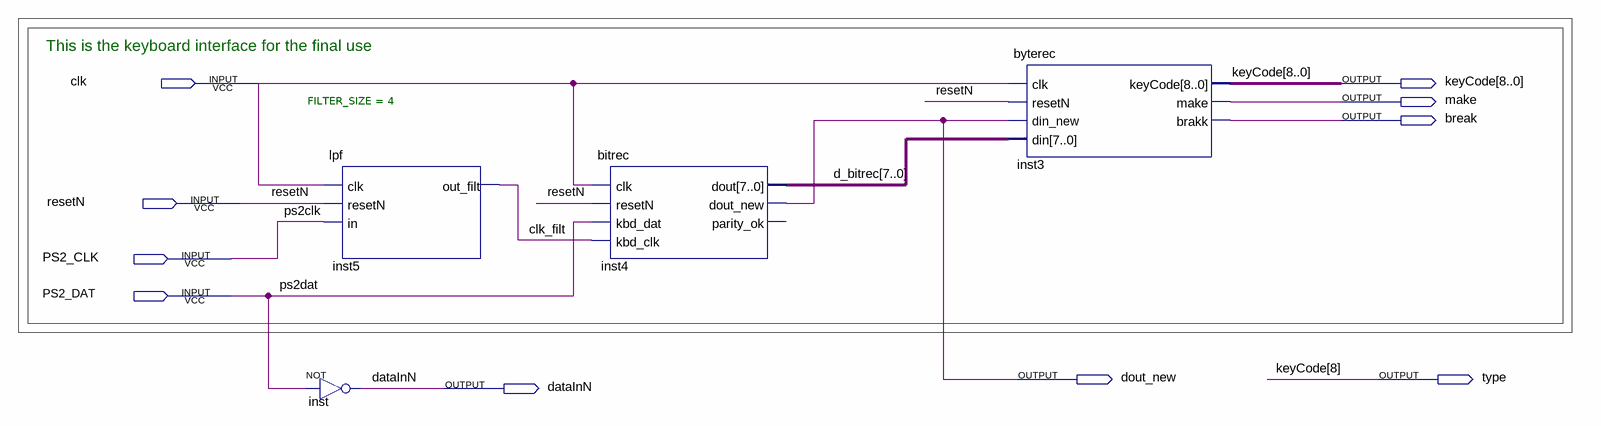
[diagram p0: schematic sheet]
// Quartus schematic KBD.bdf as structural Verilog: 4 symbols, 10 pins
module KBD (
  input  clk,
  input  resetN,
  input  PS2_CLK,
  input  PS2_DAT,
  output [8:0] keyCode,
  output make,
  output \break ,
  output dout_new,
  output \type ,
  output dataInN
);

  wire clk_filt;
  wire [7:0] d_bitrec;

  lpf #(.FILTER_SIZE(4)) inst5 (.clk(clk), .resetN(resetN), .in(PS2_CLK), .out_filt(clk_filt));
  not inst (dataInN, PS2_DAT);
  bitrec inst4 (
    .clk(clk), .resetN(resetN), .kbd_dat(PS2_DAT), .kbd_clk(clk_filt), .dout(d_bitrec), .dout_new(dout_new));  // open: parity_ok
  byterec inst3 (
    .clk(clk), .resetN(resetN), .din_new(dout_new), .din(d_bitrec), .keyCode(keyCode), .make(make),
    .brakk(\break ));

  assign \type  = keyCode[8];

  // Other names for the same wires on the sheet: ps2dat = PS2_DAT; ps2clk = PS2_CLK

  // Notes on the sheet:
  //   This is the keyboard interface for the final use 
endmodule
